# EAGLE schematic servo_cape (EAGLE 7.2.0)

## Sheet 1 of 4: Microcontroller
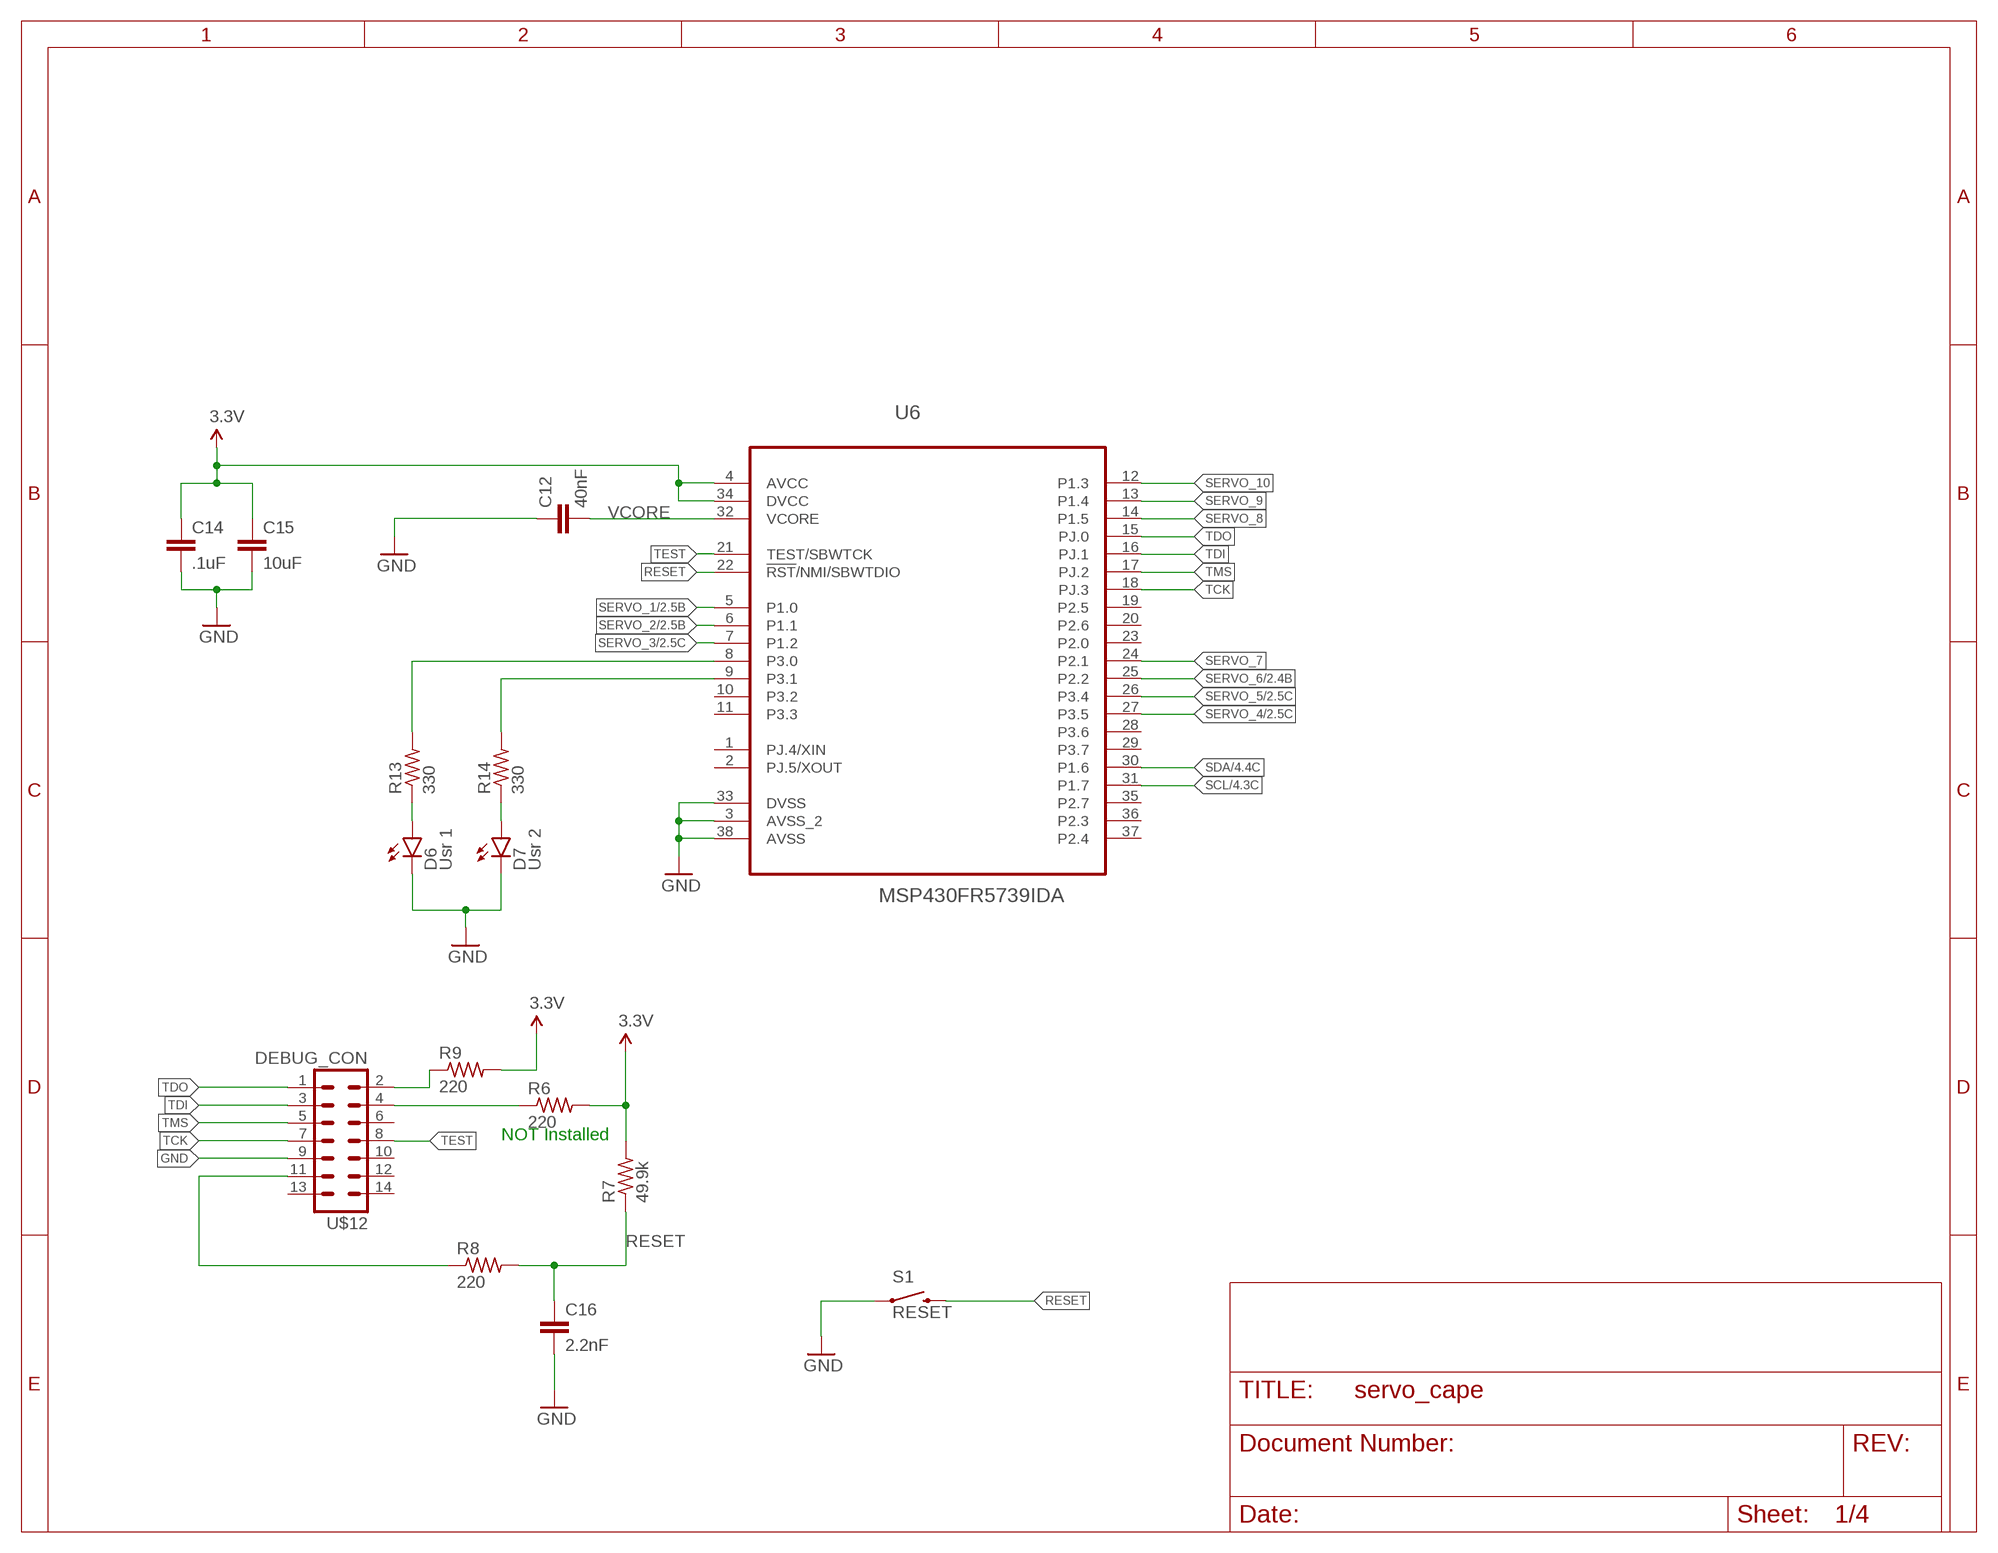
[diagram p0: schematic, sheet 1]

### Parts
C12  40nF  CAP0805  [0805]
C14  .1uF  CAP0805  [0805]
C15  10uF  CAP0805  [0805]
C16  2.2nF  CAP0805  [0805]
D6  Usr 1  LED-FKIT-1206  [FKIT-LED-1206]
D7  Usr 2  LED-FKIT-1206  [FKIT-LED-1206]
R6  220  R-US_R0805W  [R0805W]
R7  49.9k  R-US_R0805W  [R0805W]
R8  220  R-US_R0805W  [R0805W]
R9  220  R-US_R0805W  [R0805W]
R13  330  R-US_R0805W  [R0805W]
R14  330  R-US_R0805W  [R0805W]
S1  RESET  SWITCH-MOMENTARY-2SMD-4  [TACTILE_SWITCH_TALL]
U6  MSP430FR5739IDA  [SOP65P810X120-38N]
U$12  DEBUG_CON  [DEBUG_SM]

### Nets
3.3V: C14.1 C15.1 R6.2 R7.2 R9.2 U6.4(AVCC) U6.34(DVCC) ; also sheet 3,4
GND: C12.1 C14.2 C15.2 C16.2 D6.C D7.C S1.A2 U6.3(AVSS_2) U6.33(DVSS) U6.38(AVSS) U$12.9 ; also sheet 2,3,4
N$1: R14.2 U6.9(P3.1)
N$4: R6.1 U$12.4
N$5: D6.A R13.1
N$7: D7.A R14.1
N$8: R8.1 U$12.11
N$9: R9.1 U$12.2
N$10: R13.2 U6.8(P3.0)
RESET: C16.1 R7.1 R8.2 S1.B2 U6.22(!RST!/NMI/SBWTDIO)
SCL: U6.31(P1.7) ; also sheet 4
SDA: U6.30(P1.6) ; also sheet 4
SERVO_1: U6.5(P1.0) ; also sheet 2
SERVO_2: U6.6(P1.1) ; also sheet 2
SERVO_3: U6.7(P1.2) ; also sheet 2
SERVO_4: U6.27(P3.5) ; also sheet 2
SERVO_5: U6.26(P3.4) ; also sheet 2
SERVO_6: U6.25(P2.2) ; also sheet 2
SERVO_7: U6.24(P2.1) ; also sheet 2
SERVO_8: U6.14(P1.5)
SERVO_9: U6.13(P1.4)
SERVO_10: U6.12(P1.3)
TCK: U6.18(PJ.3) U$12.7
TDI: U6.16(PJ.1) U$12.3
TDO: U6.15(PJ.0) U$12.1
TEST: U6.21(TEST/SBWTCK) U$12.8
TMS: U6.17(PJ.2) U$12.5
VCORE: C12.2 U6.32(VCORE)
Unconnected: U6.1(PJ.4/XIN) U6.2(PJ.5/XOUT) U6.10(P3.2) U6.11(P3.3) U6.19(P2.5) U6.20(P2.6) U6.23(P2.0) U6.28(P3.6) U6.29(P3.7) U6.35(P2.7) U6.36(P2.3) U6.37(P2.4) U$12.6 U$12.10 U$12.12 U$12.13 U$12.14

### Notes on the sheet
- NOT Installed

## Sheet 2 of 4: Sensor
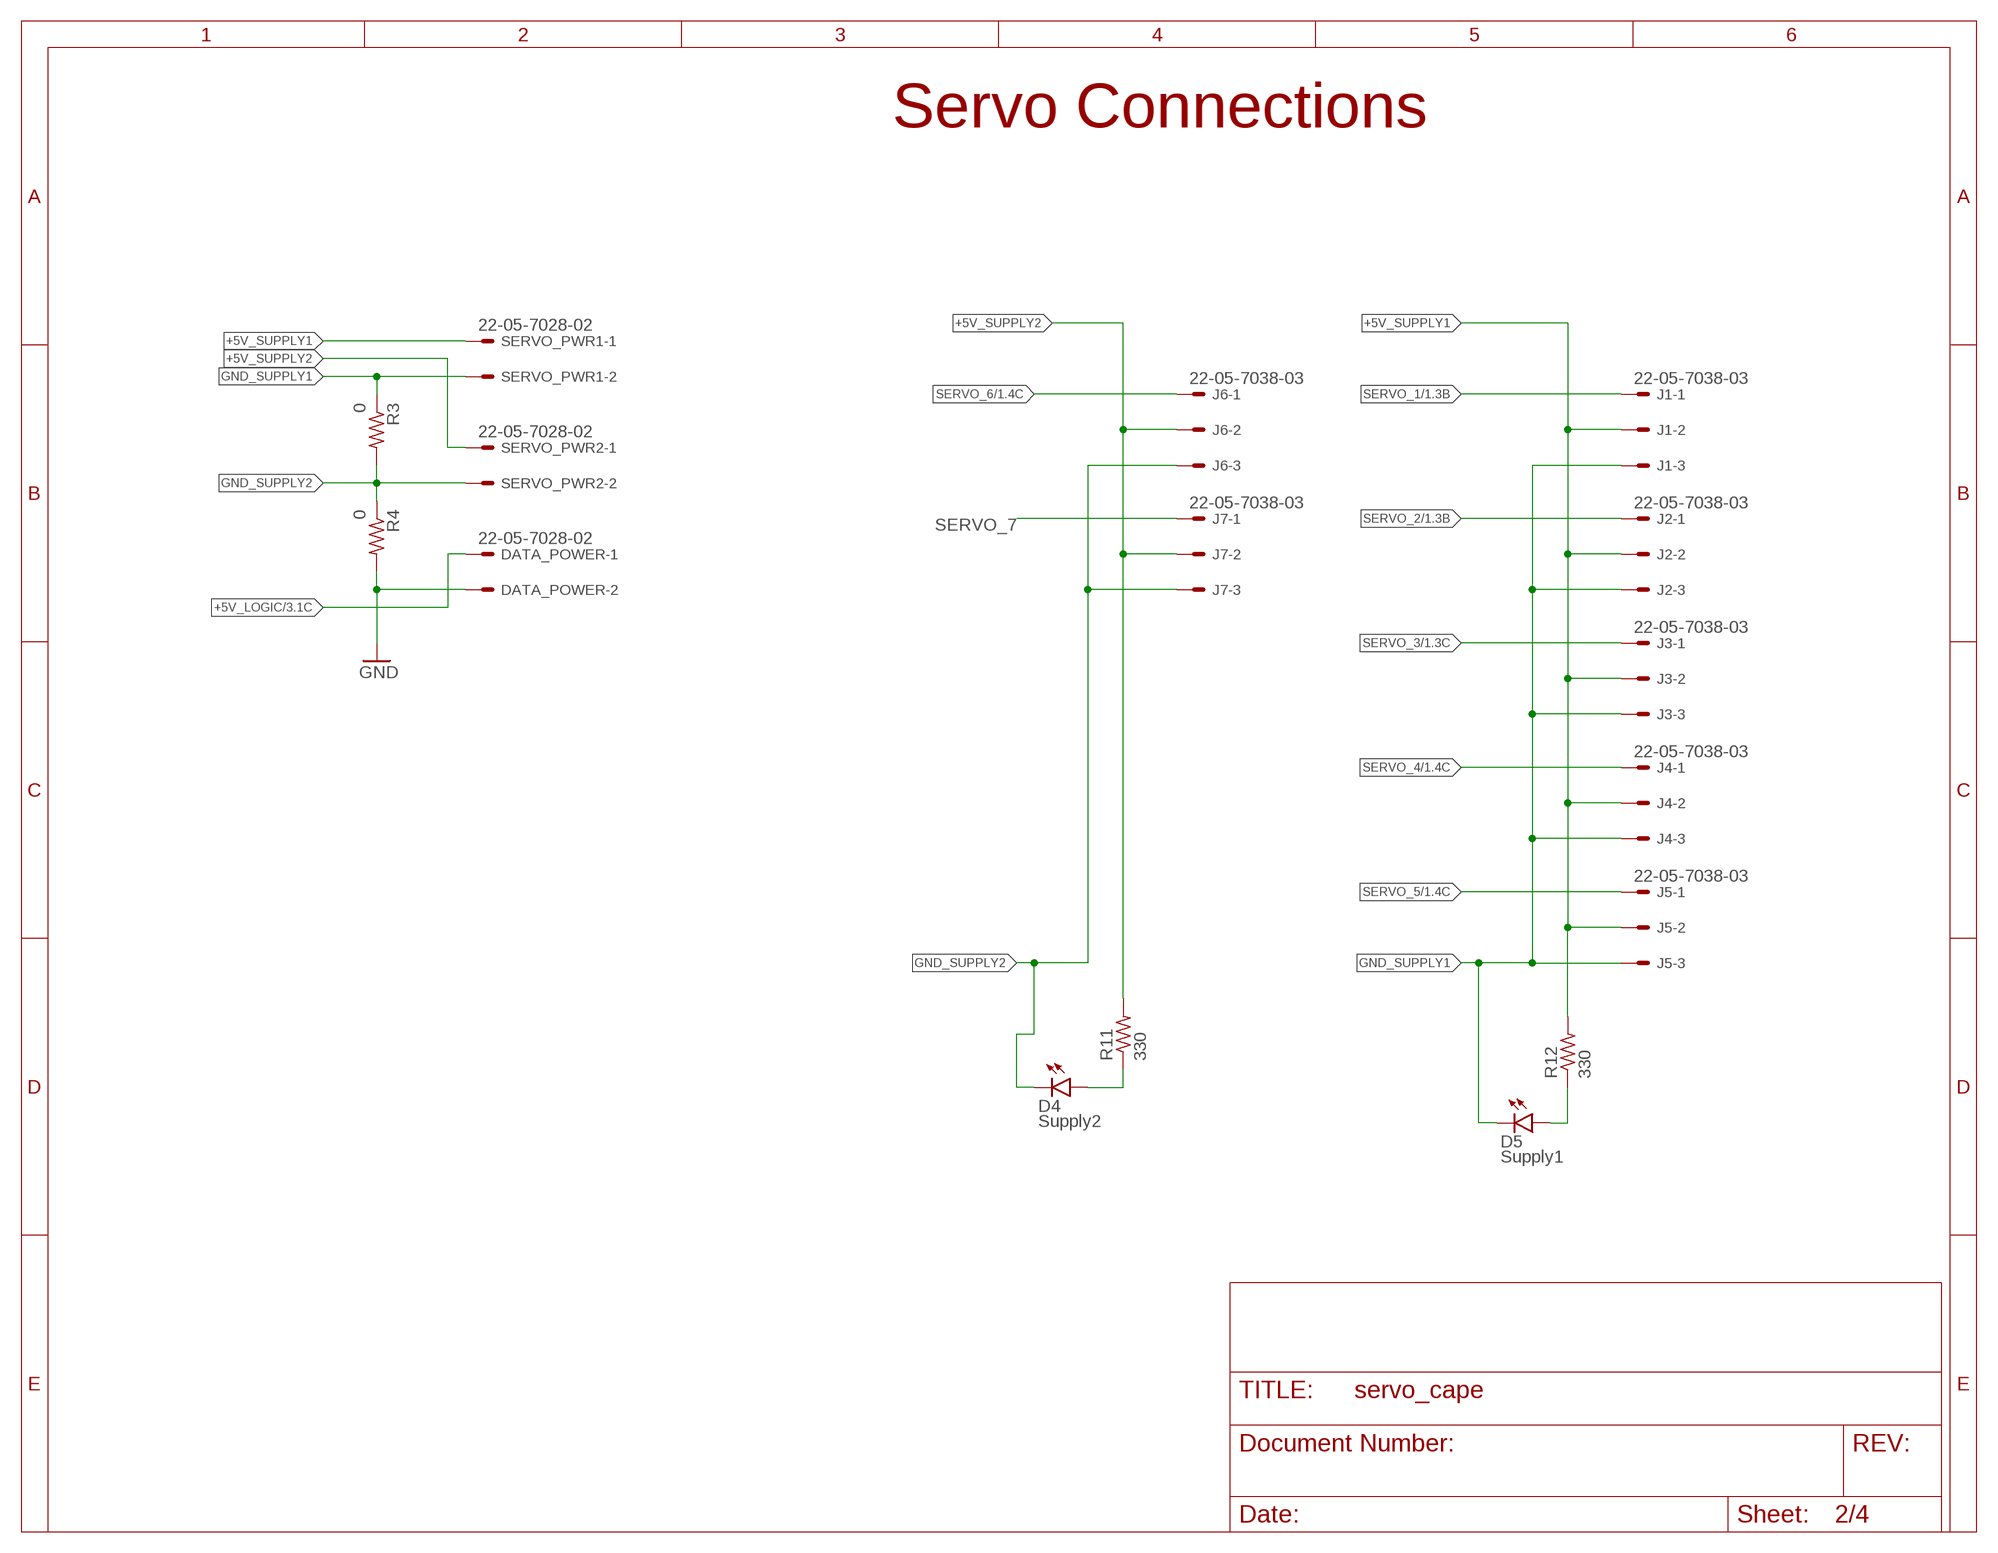
[diagram p1: schematic, sheet 2]

### Parts
D4  Supply2  LED-FKIT-1206  [FKIT-LED-1206]
D5  Supply1  LED-FKIT-1206  [FKIT-LED-1206]
DATA_POWER  22-05-7028-02  [7395-02]
J1  22-05-7038-03  [7395-03]
J2  22-05-7038-03  [7395-03]
J3  22-05-7038-03  [7395-03]
J4  22-05-7038-03  [7395-03]
J5  22-05-7038-03  [7395-03]
J6  22-05-7038-03  [7395-03]
J7  22-05-7038-03  [7395-03]
R3  0  R-US_R0805W  [R0805W]
R4  0  R-US_R0805W  [R0805W]
R11  330  R-US_R0805W  [R0805W]
R12  330  R-US_R0805W  [R0805W]
SERVO_PWR1  22-05-7028-02  [7395-02]
SERVO_PWR2  22-05-7028-02  [7395-02]

### Nets
+5V_LOGIC: DATA_POWER.1 ; also sheet 3
+5V_SUPPLY1: J1.2 J2.2 J3.2 J4.2 J5.2 R12.2 SERVO_PWR1.1
+5V_SUPPLY2: J6.2 J7.2 R11.2 SERVO_PWR2.1
GND: DATA_POWER.2 R4.2 ; also sheet 1,3,4
GND_SUPPLY1: D5.C J1.3 J2.3 J3.3 J4.3 J5.3 R3.1 SERVO_PWR1.2
GND_SUPPLY2: D4.C J6.3 J7.3 R3.2 R4.1 SERVO_PWR2.2
N$2: D5.A R12.1
N$3: D4.A R11.1
SERVO_1: J1.1 ; also sheet 1
SERVO_2: J2.1 ; also sheet 1
SERVO_3: J3.1 ; also sheet 1
SERVO_4: J4.1 ; also sheet 1
SERVO_5: J5.1 ; also sheet 1
SERVO_6: J6.1 ; also sheet 1
SERVO_7: J7.1 ; also sheet 1

### Notes on the sheet
- Servo Connections

## Sheet 3 of 4: Power
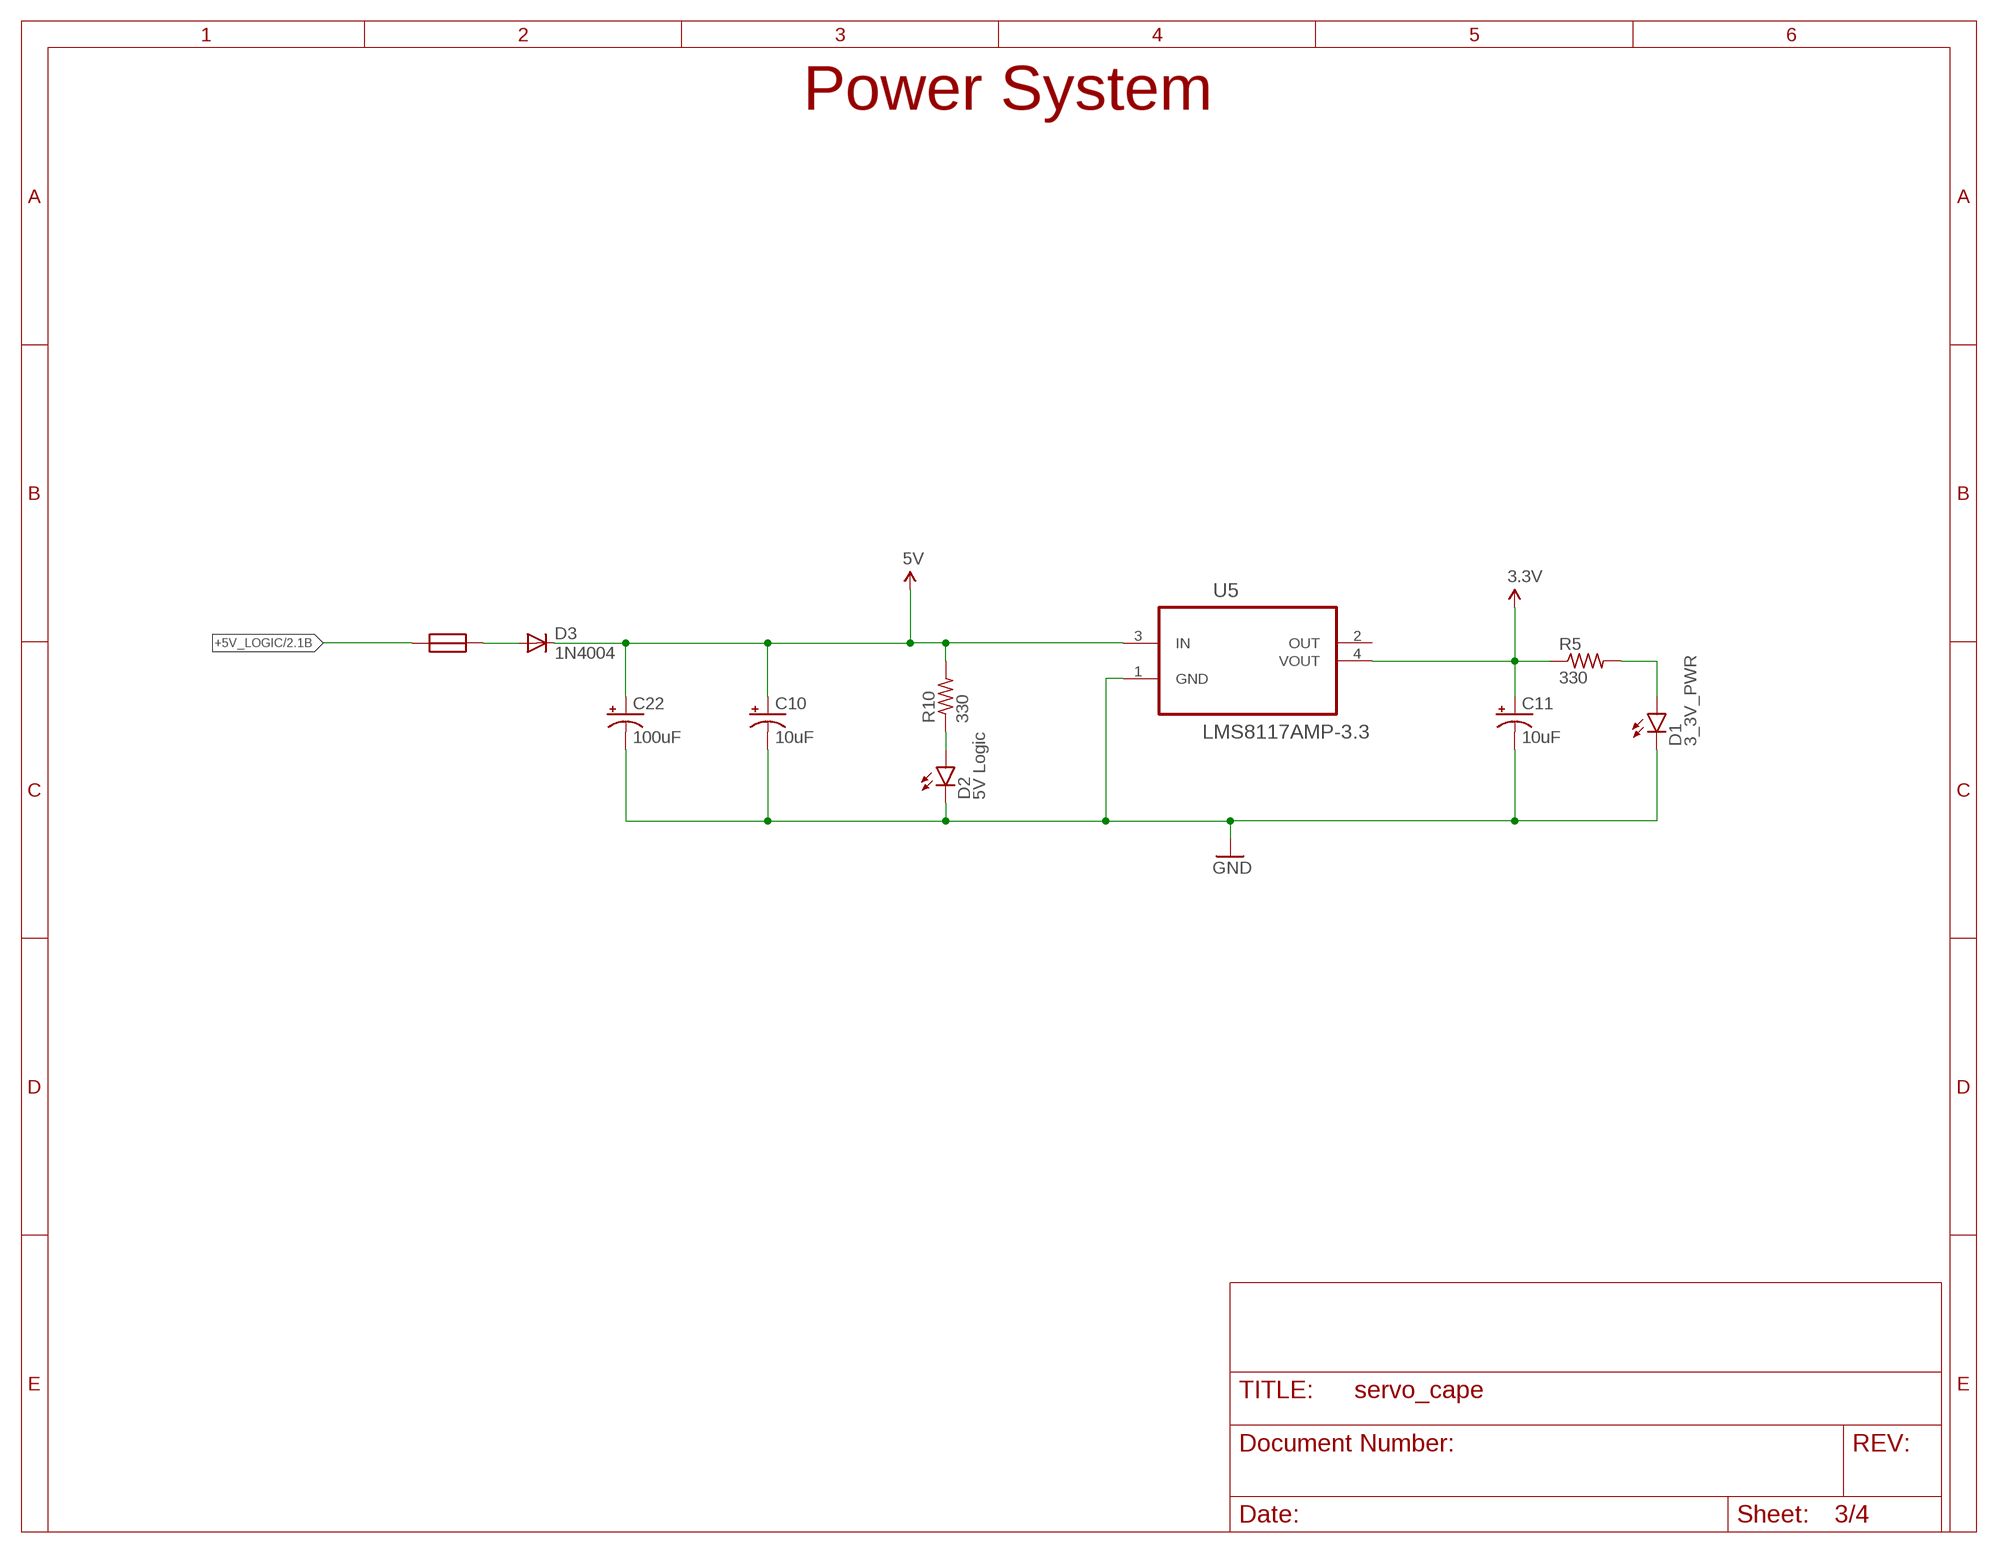
[diagram p2: schematic, sheet 3]

### Parts
C10  10uF  10UF-16V-10%(TANT)  [EIA3216]
C11  10uF  10UF-16V-10%(TANT)  [EIA3216]
C22  100uF  100UF-10V-10%(TANT)  [EIA7343]
D1  3_3V_PWR  LED-FKIT-1206  [FKIT-LED-1206]
D2  5V Logic  LED-FKIT-1206  [FKIT-LED-1206]
D3  1N4004  [DO41-10]
R5  330  R-US_R0805W  [R0805W]
R10  330  R-US_R0805W  [R0805W]
U5  LMS8117AMP-3.3  [SOT230P696X180-4N]
U$3  NANO_FUSE  [NANO_FUSE]

### Nets
3.3V: C11.A(+) R5.1 U5.4(VOUT) ; also sheet 1,4
5V: C10.A(+) C22.A(+) D3.C R10.2 U5.3(IN)
+5V_LOGIC: U$3.1 ; also sheet 2
GND: C10.C(-) C11.C(-) C22.C(-) D1.C D2.C U5.1(GND) ; also sheet 1,2,4
N$6: D1.A R5.2
N$13: D2.A R10.1
N$14: D3.A U$3.2
Unconnected: U5.2(OUT)

### Notes on the sheet
- Power System

## Sheet 4 of 4: Interboard Connector
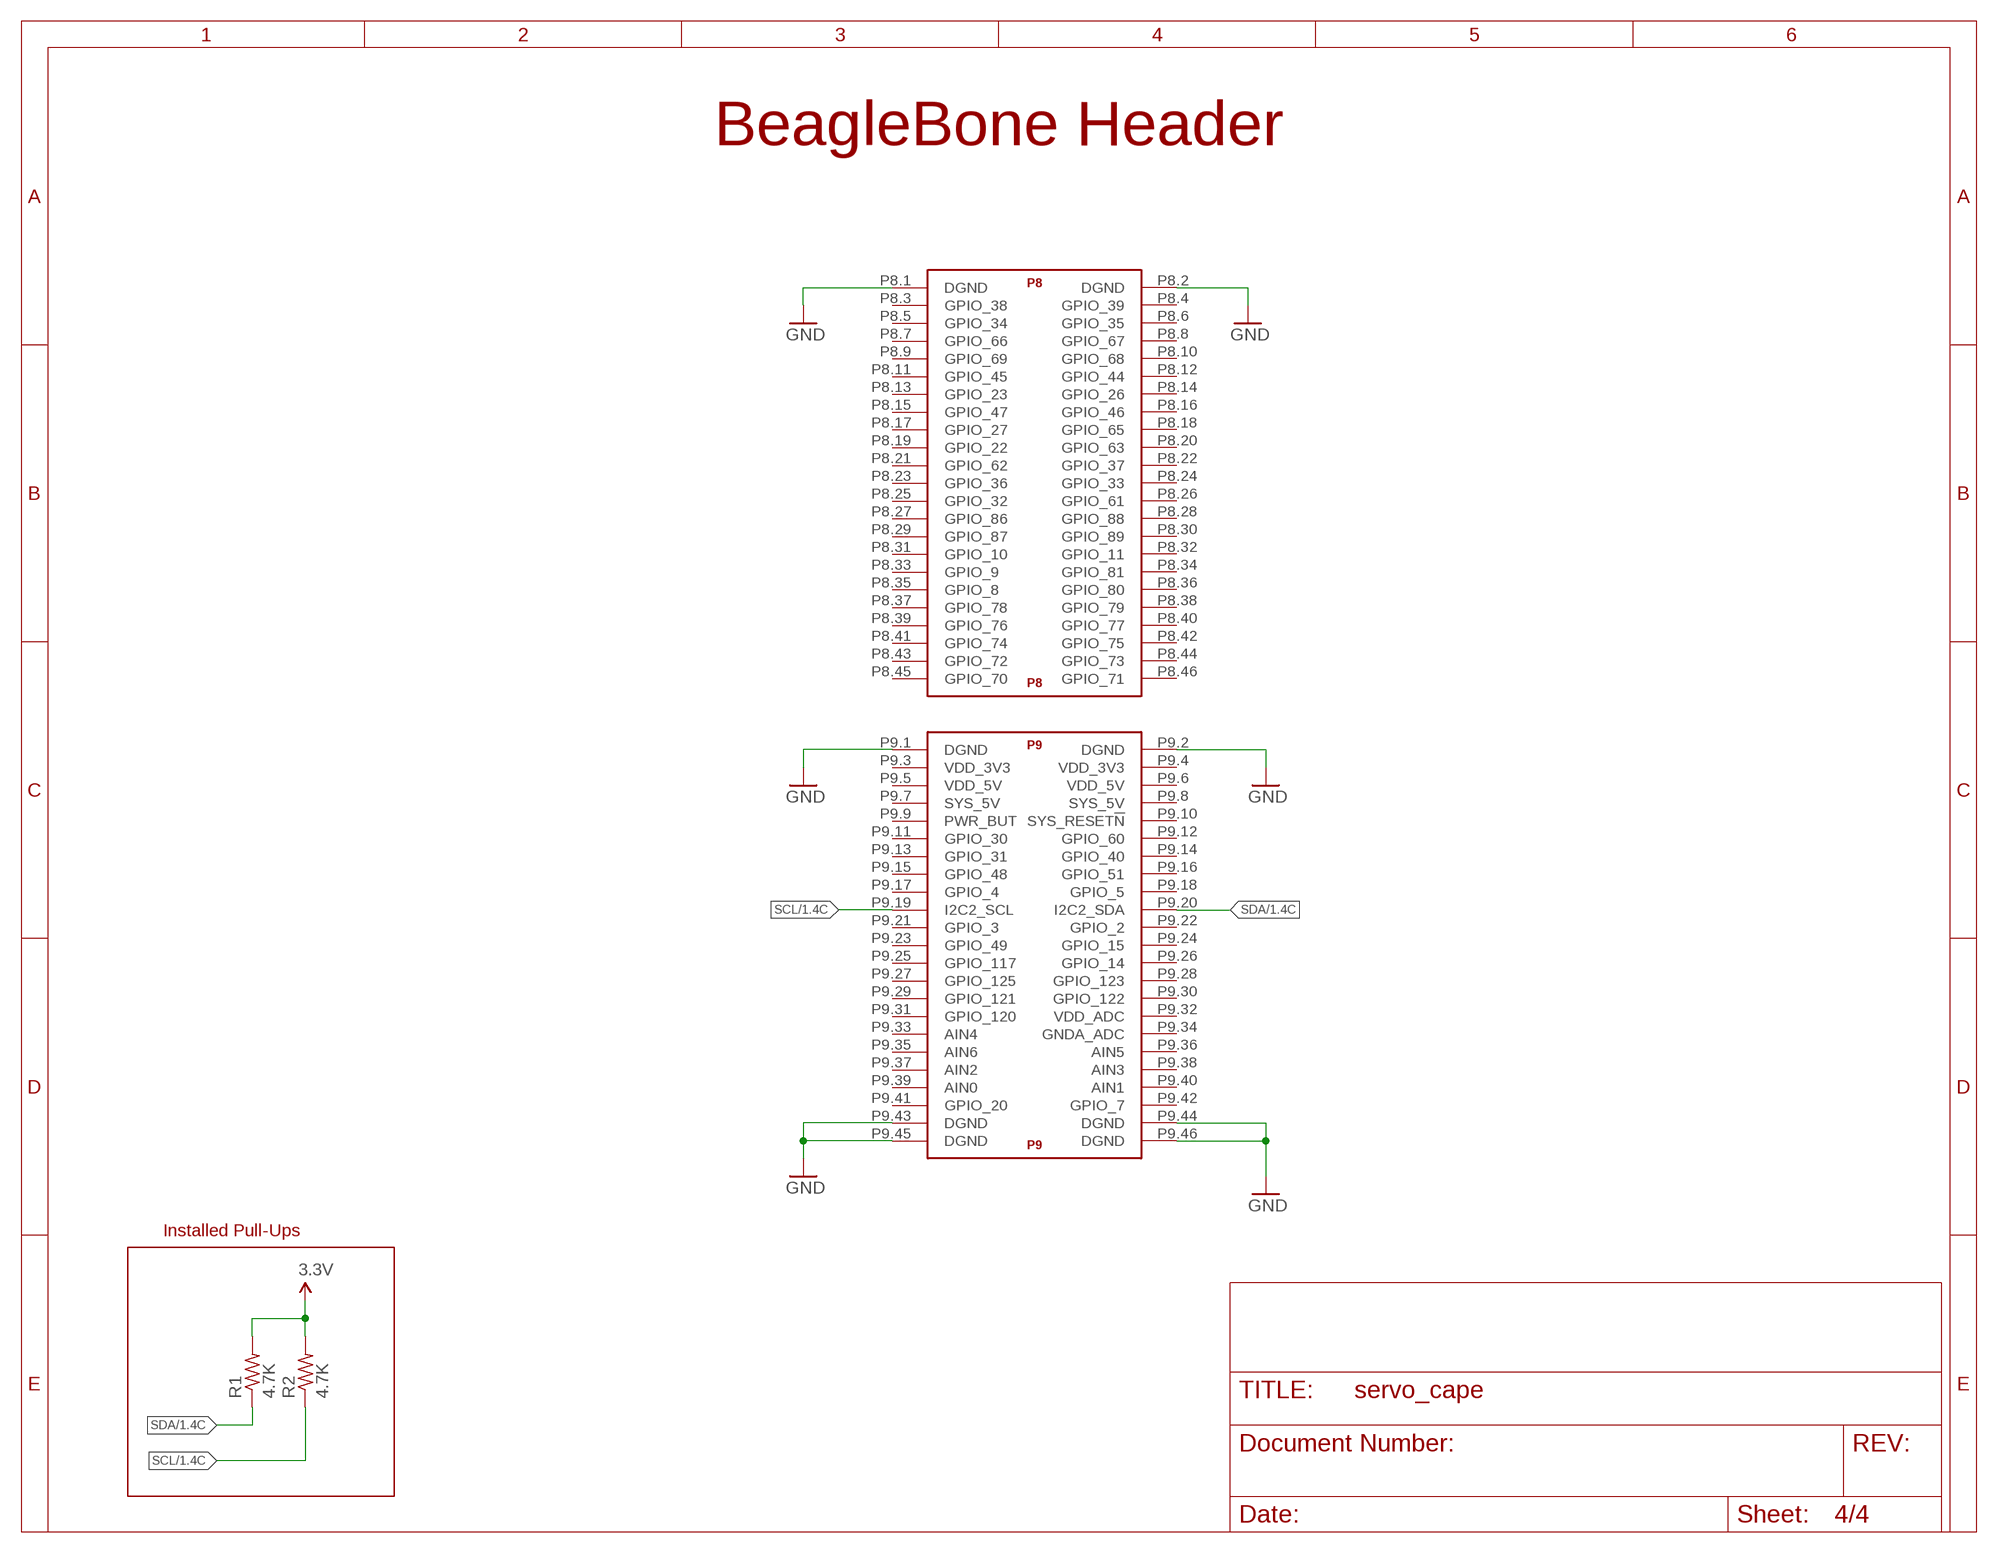
[diagram p3: schematic, sheet 4]

### Parts
R1  4.7K  R-US_R0805W  [R0805W]
R2  4.7K  R-US_R0805W  [R0805W]
U$1  BEAGLE_BONE_BLACK_CAPE  [BEAGLE_BONE_BLACK_CAPE]

### Nets
3.3V: R1.2 R2.2 ; also sheet 1,3
GND: U$1.P8.1(P8:DGND) U$1.P8.2(P8:DGND) U$1.P9.1(P9:DGND) U$1.P9.2(P9:DGND) U$1.P9.43(P9:DGND) U$1.P9.44(P9:DGND) U$1.P9.45(P9:DGND) U$1.P9.46(P9:DGND) ; also sheet 1,2,3
SCL: R2.1 U$1.P9.19(P9:I2C2_SCL) ; also sheet 1
SDA: R1.1 U$1.P9.20(P9:I2C2_SDA) ; also sheet 1
Unconnected: U$1.P8.3(P8:GPIO_38) U$1.P8.4(P8:GPIO_39) U$1.P8.5(P8:GPIO_34) U$1.P8.6(P8:GPIO_35) U$1.P8.7(P8:GPIO_66) U$1.P8.8(P8:GPIO_67) U$1.P8.9(P8:GPIO_69) U$1.P8.10(P8:GPIO_68) U$1.P8.11(P8:GPIO_45) U$1.P8.12(P8:GPIO_44) U$1.P8.13(P8:GPIO_23) U$1.P8.14(P8:GPIO_26) U$1.P8.15(P8:GPIO_47) U$1.P8.16(P8:GPIO_46) U$1.P8.17(P8:GPIO_27) U$1.P8.18(P8:GPIO_65) U$1.P8.19(P8:GPIO_22) U$1.P8.20(P8:GPIO_63) U$1.P8.21(P8:GPIO_62) U$1.P8.22(P8:GPIO_37) U$1.P8.23(P8:GPIO_36) U$1.P8.24(P8:GPIO_33) U$1.P8.25(P8:GPIO_32) U$1.P8.26(P8:GPIO_61) U$1.P8.27(P8:GPIO_86) U$1.P8.28(P8:GPIO_88) U$1.P8.29(P8:GPIO_87) U$1.P8.30(P8:GPIO_89) U$1.P8.31(P8:GPIO_10) U$1.P8.32(P8:GPIO_11) U$1.P8.33(P8:GPIO_9) U$1.P8.34(P8:GPIO_81) U$1.P8.35(P8:GPIO_8) U$1.P8.36(P8:GPIO_80) U$1.P8.37(P8:GPIO_78) U$1.P8.38(P8:GPIO_79) U$1.P8.39(P8:GPIO_76) U$1.P8.40(P8:GPIO_77) U$1.P8.41(P8:GPIO_74) U$1.P8.42(P8:GPIO_75) U$1.P8.43(P8:GPIO_72) U$1.P8.44(P8:GPIO_73) U$1.P8.45(P8:GPIO_70) U$1.P8.46(P8:GPIO_71) U$1.P9.3(P9:VDD_3V3) U$1.P9.4(P9:VDD_3V3) U$1.P9.5(P9:VDD_5V) U$1.P9.6(P9:VDD_5V) U$1.P9.7(P9:SYS_5V) U$1.P9.8(P9:SYS_5V) U$1.P9.9(P9:PWR_BUT) U$1.P9.10(P9:SYS_RESET!N) U$1.P9.11(P9:GPIO_30) U$1.P9.12(P9:GPIO_60) U$1.P9.13(P9:GPIO_31) U$1.P9.14(P9:GPIO_40) U$1.P9.15(P9:GPIO_48) U$1.P9.16(P9:GPIO_51) U$1.P9.17(P9:GPIO_4) U$1.P9.18(P9:GPIO_5) U$1.P9.21(P9:GPIO_3) U$1.P9.22(P9:GPIO_2) U$1.P9.23(P9:GPIO_49) U$1.P9.24(P9:GPIO_15) U$1.P9.25(P9:GPIO_117) U$1.P9.26(P9:GPIO_14) U$1.P9.27(P9:GPIO_125) U$1.P9.28(P9:GPIO_123) U$1.P9.29(P9:GPIO_121) U$1.P9.30(P9:GPIO_122) U$1.P9.31(P9:GPIO_120) U$1.P9.32(P9:VDD_ADC) U$1.P9.33(P9:AIN4) U$1.P9.34(P9:GNDA_ADC) U$1.P9.35(P9:AIN6) U$1.P9.36(P9:AIN5) U$1.P9.37(P9:AIN2) U$1.P9.38(P9:AIN3) U$1.P9.39(P9:AIN0) U$1.P9.40(P9:AIN1) U$1.P9.41(P9:GPIO_20) U$1.P9.42(P9:GPIO_7)

### Notes on the sheet
- BeagleBone Header
- Installed Pull-Ups

## Library data of the parts
C10 C11 = SparkFun-Capacitors:10UF-16V-10%(TANT): CAP-00811 1206/EIA-3216 Tantalum capacitor; PROD_ID: CAP-00811
C12 C14-C16 = SparkFun-Capacitors:CAP: Capacitor Standard 0603 ceramic capacitor, and 0.1" leaded capacitor.
C22 = SparkFun-Capacitors:100UF-10V-10%(TANT): CAP-07890; PROD_ID: CAP-07890
D1 D2 D4-D7 = SparkFun-LED:LED: LEDs Standard schematic elements and footprints for 5mm, 3mm, 1206, and 0603 sized LEDs. 5mm - Spark Fun Electronics SKU : COM-00529 (and others)
D3 = diode:1N4004: DIODE general purpose rectifier, 1 A
DATA_POWER SERVO_PWR1 SERVO_PWR2 = con-molex:22-?-02: CONNECTOR wire to board 2.54 mm (.1 inch) pitch header; OC_FARNELL: 9731601; OC_NEWARK: unknown
J1-J7 = con-molex:22-?-03: CONNECTOR wire to board 2.54 mm (.1 inch) pitch header; OC_FARNELL: unknown; OC_NEWARK: unknown
R1-R14 = rcl:R-US_: RESISTOR, American symbol
S1 = SparkFun-Electromechanical:SWITCH-MOMENTARY-2: Various NO switches- pushbuttons, reed, etc; PROD_ID: SWCH-11966
U5 = NSC-LMS8117AMP:LMS8117AMP-3.3: Low-Dropout Linear Regulator; MPN: LMS8117AMP-3.3; OC_FARNELL: 1469032; OC_NEWARK: 41K3020; PACKAGE: SOT-223-3; SUPPLIER: National Semiconductor
U6 = TI-MSP430FR5739:MSP430FR5739IDA: Mixed Signal Microcontroller,TSSOP-38; MPN: MSP430FR5739IDA; OC_FARNELL: 2148662; OC_NEWARK: 28W4632; PACKAGE: TSSOP-38; SUPPLIER: TEXAS INSTRUMENTS
U$1 = SparkFun-Boards:BEAGLE_BONE_BLACK_CAPE
U$3 = custom_fuses:NANO_FUSE
U$12 = range_cape:DEBUG_CON

## Net classes
0 default: width 0.203 mm, drill 0.508 mm, clearance 0.254 mm